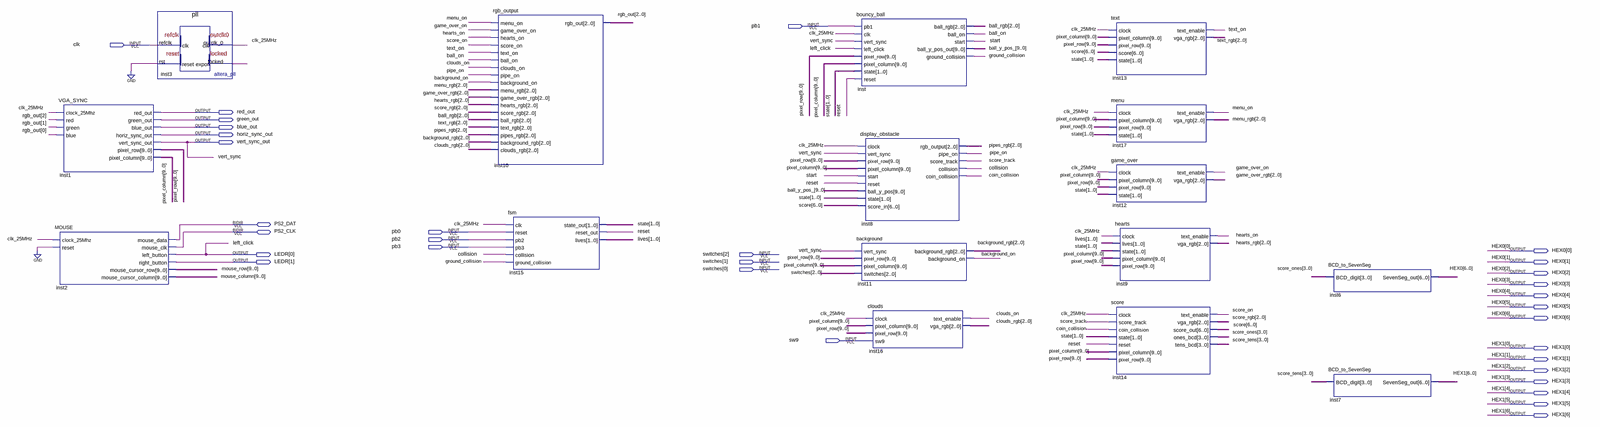
[diagram p0: schematic sheet, whole]
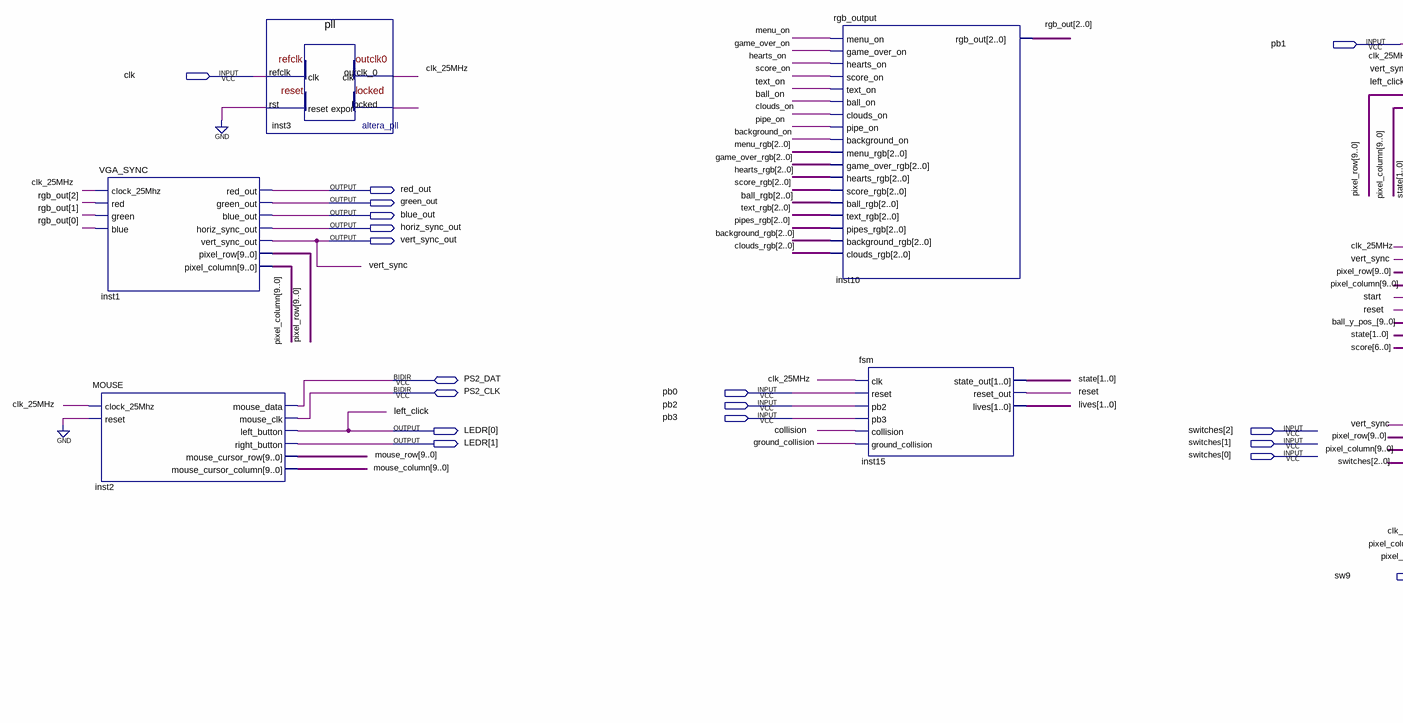
[diagram p1: schematic sheet, left part]
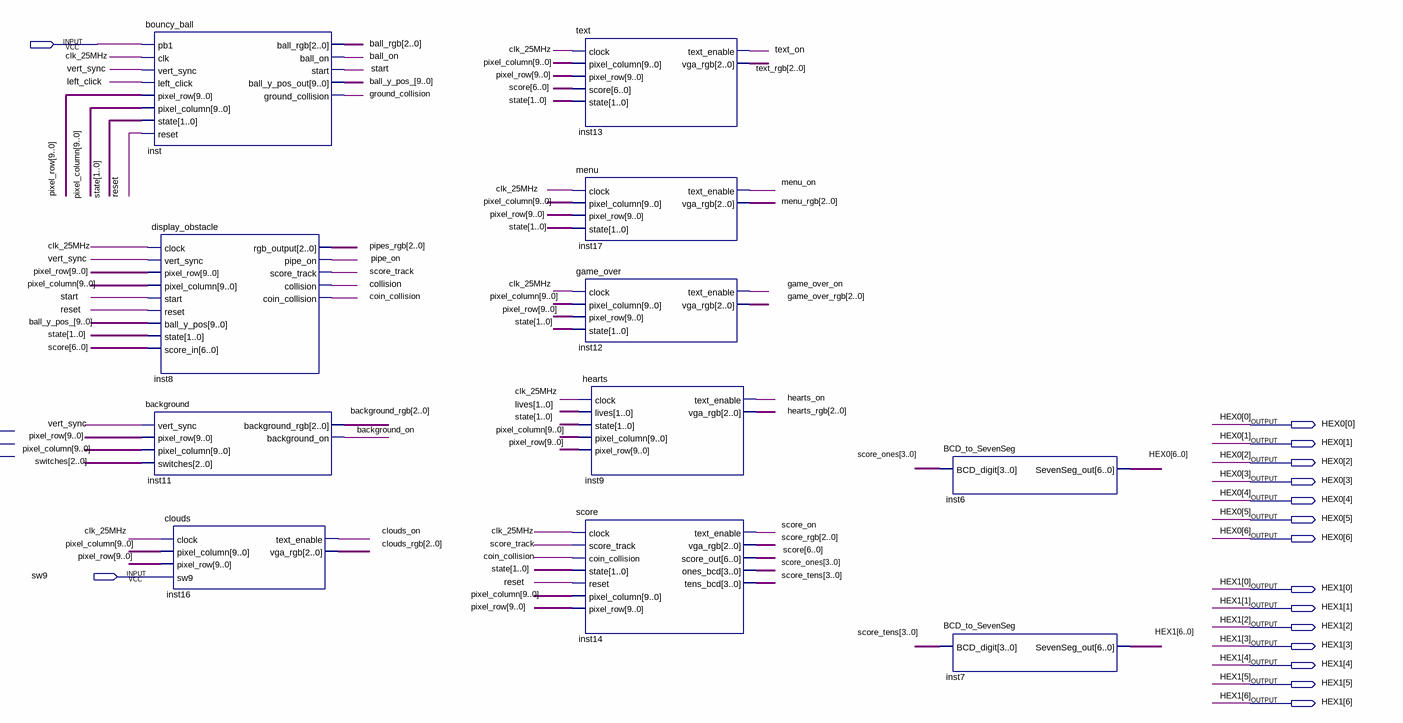
[diagram p2: schematic sheet, right part]
// Quartus schematic flappybird.bdf as structural Verilog: 16 symbols, 32 pins
module flappybird (
  input  pb1,
  input  clk,
  input  pb0,
  input  pb2,
  input  pb3,
  input  [2:0] switches,
  input  sw9,
  inout  PS2_DAT,
  inout  PS2_CLK,
  output red_out,
  output green_out,
  output blue_out,
  output horiz_sync_out,
  output vert_sync_out,
  output [6:0] HEX0,
  output [1:0] LEDR,
  output [6:0] HEX1
);

  wire background_on, ball_on, clk_25MHz, clouds_on, coin_collision, collision, game_over_on,
       ground_collision, hearts_on, inst3_locked, menu_on, pipe_on, reset, score_on, score_track, start,
       text_on;
  wire [1:0] lives, state;
  wire [2:0] background_rgb, ball_rgb, clouds_rgb, game_over_rgb, hearts_rgb, menu_rgb, pipes_rgb, rgb_out,
       score_rgb, text_rgb;
  wire [3:0] score_ones, score_tens;
  wire [6:0] score;
  wire [9:0] ball_y_pos_, mouse_column, mouse_row, pixel_column, pixel_row;

  VGA_SYNC inst1 (
    .clock_25Mhz(clk_25MHz), .red(rgb_out[2]), .green(rgb_out[1]), .blue(rgb_out[0]), .red_out(red_out),
    .green_out(green_out), .blue_out(blue_out), .horiz_sync_out(horiz_sync_out),
    .vert_sync_out(vert_sync_out), .pixel_row(pixel_row), .pixel_column(pixel_column));
  MOUSE inst2 (
    .clock_25Mhz(clk_25MHz), .reset(1'b0), .left_button(LEDR[0]), .right_button(LEDR[1]),
    .mouse_cursor_row(mouse_row), .mouse_cursor_column(mouse_column), .mouse_data(PS2_DAT),
    .mouse_clk(PS2_CLK));
  pll inst3 (.refclk(clk), .rst(1'b0), .outclk_0(clk_25MHz), .locked(inst3_locked));
  rgb_output inst10 (
    .menu_on(menu_on), .game_over_on(game_over_on), .hearts_on(hearts_on), .score_on(score_on),
    .text_on(text_on), .ball_on(ball_on), .clouds_on(clouds_on), .pipe_on(pipe_on),
    .background_on(background_on), .menu_rgb(menu_rgb), .game_over_rgb(game_over_rgb),
    .hearts_rgb(hearts_rgb), .score_rgb(score_rgb), .ball_rgb(ball_rgb), .text_rgb(text_rgb),
    .pipes_rgb(pipes_rgb), .background_rgb(background_rgb), .clouds_rgb(clouds_rgb), .rgb_out(rgb_out));
  fsm inst15 (
    .clk(clk_25MHz), .reset(pb0), .pb2(pb2), .pb3(pb3), .collision(collision),
    .ground_collision(ground_collision), .state_out(state), .reset_out(reset), .lives(lives));
  bouncy_ball inst (
    .pb1(pb1), .clk(clk_25MHz), .vert_sync(vert_sync_out), .left_click(LEDR[0]), .pixel_row(pixel_row),
    .pixel_column(pixel_column), .state(state), .reset(reset), .ball_rgb(ball_rgb), .ball_on(ball_on),
    .start(start), .ball_y_pos_out(ball_y_pos_), .ground_collision(ground_collision));
  display_obstacle inst8 (
    .clock(clk_25MHz), .vert_sync(vert_sync_out), .pixel_row(pixel_row), .pixel_column(pixel_column),
    .start(start), .reset(reset), .ball_y_pos(ball_y_pos_), .state(state), .score_in(score),
    .rgb_output(pipes_rgb), .pipe_on(pipe_on), .score_track(score_track), .collision(collision),
    .coin_collision(coin_collision));
  background inst11 (
    .vert_sync(vert_sync_out), .pixel_row(pixel_row), .pixel_column(pixel_column), .switches(switches),
    .background_rgb(background_rgb), .background_on(background_on));
  clouds inst16 (
    .clock(clk_25MHz), .pixel_column(pixel_column), .pixel_row(pixel_row), .sw9(sw9),
    .text_enable(clouds_on), .vga_rgb(clouds_rgb));
  text inst13 (
    .clock(clk_25MHz), .pixel_column(pixel_column), .pixel_row(pixel_row), .score(score), .state(state),
    .text_enable(text_on), .vga_rgb(text_rgb));
  menu inst17 (
    .clock(clk_25MHz), .pixel_column(pixel_column), .pixel_row(pixel_row), .state(state),
    .text_enable(menu_on), .vga_rgb(menu_rgb));
  game_over inst12 (
    .clock(clk_25MHz), .pixel_column(pixel_column), .pixel_row(pixel_row), .state(state),
    .text_enable(game_over_on), .vga_rgb(game_over_rgb));
  score inst14 (
    .clock(clk_25MHz), .score_track(score_track), .coin_collision(coin_collision), .state(state),
    .reset(reset), .pixel_column(pixel_column), .pixel_row(pixel_row), .text_enable(score_on),
    .vga_rgb(score_rgb), .score_out(score), .ones_bcd(score_ones), .tens_bcd(score_tens));
  hearts inst9 (
    .clock(clk_25MHz), .lives(lives), .state(state), .pixel_column(pixel_column), .pixel_row(pixel_row),
    .text_enable(hearts_on), .vga_rgb(hearts_rgb));
  BCD_to_SevenSeg inst6 (.BCD_digit(score_ones), .SevenSeg_out(HEX0));
  BCD_to_SevenSeg inst7 (.BCD_digit(score_tens), .SevenSeg_out(HEX1));

  // Other names for the same wires on the sheet: left_click = LEDR[0]; vert_sync = vert_sync_out
endmodule
